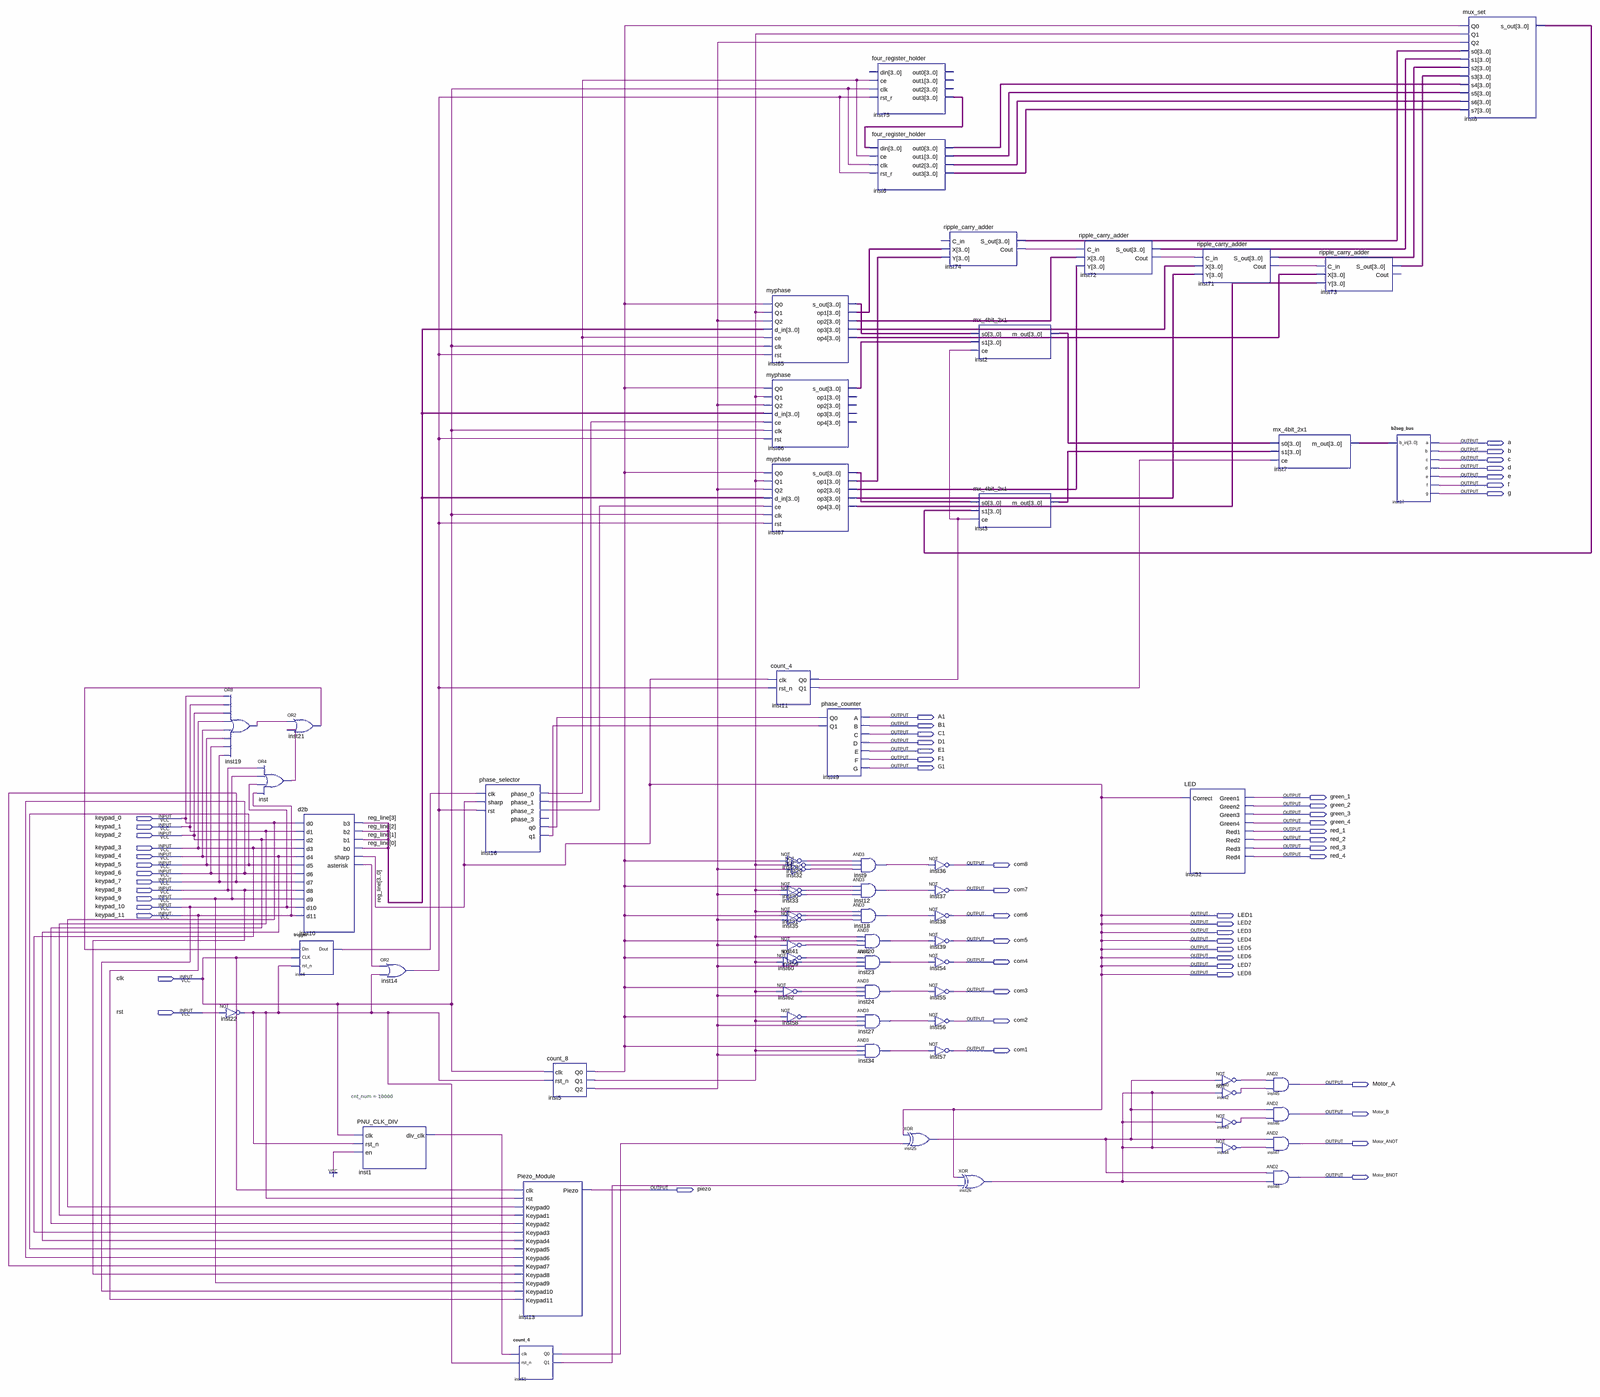
[diagram p0: schematic sheet, whole]
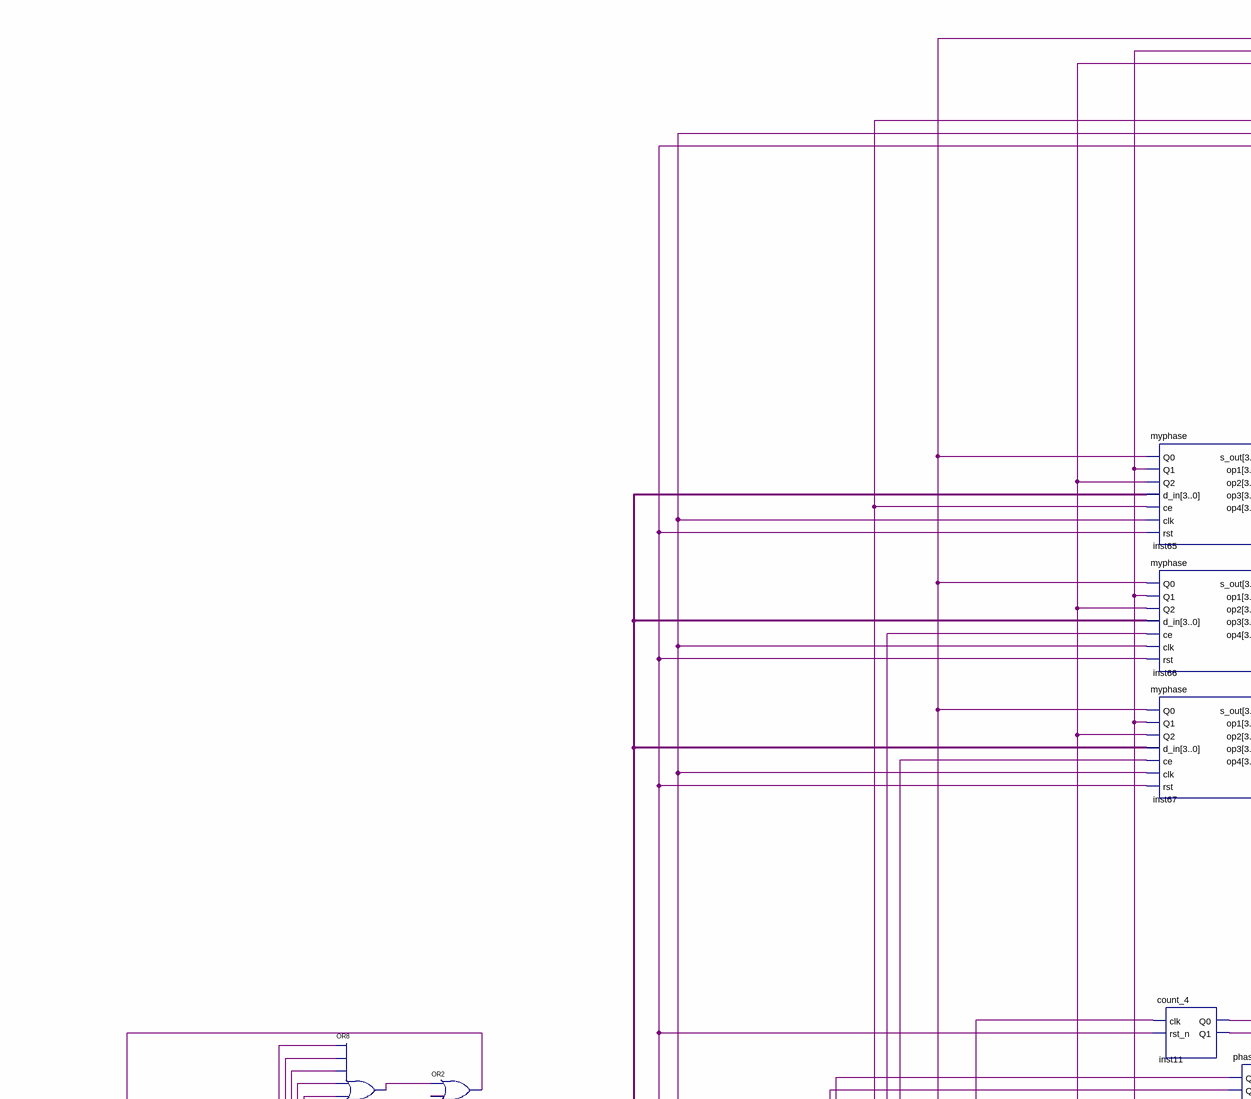
[diagram p1: schematic sheet, upper left part]
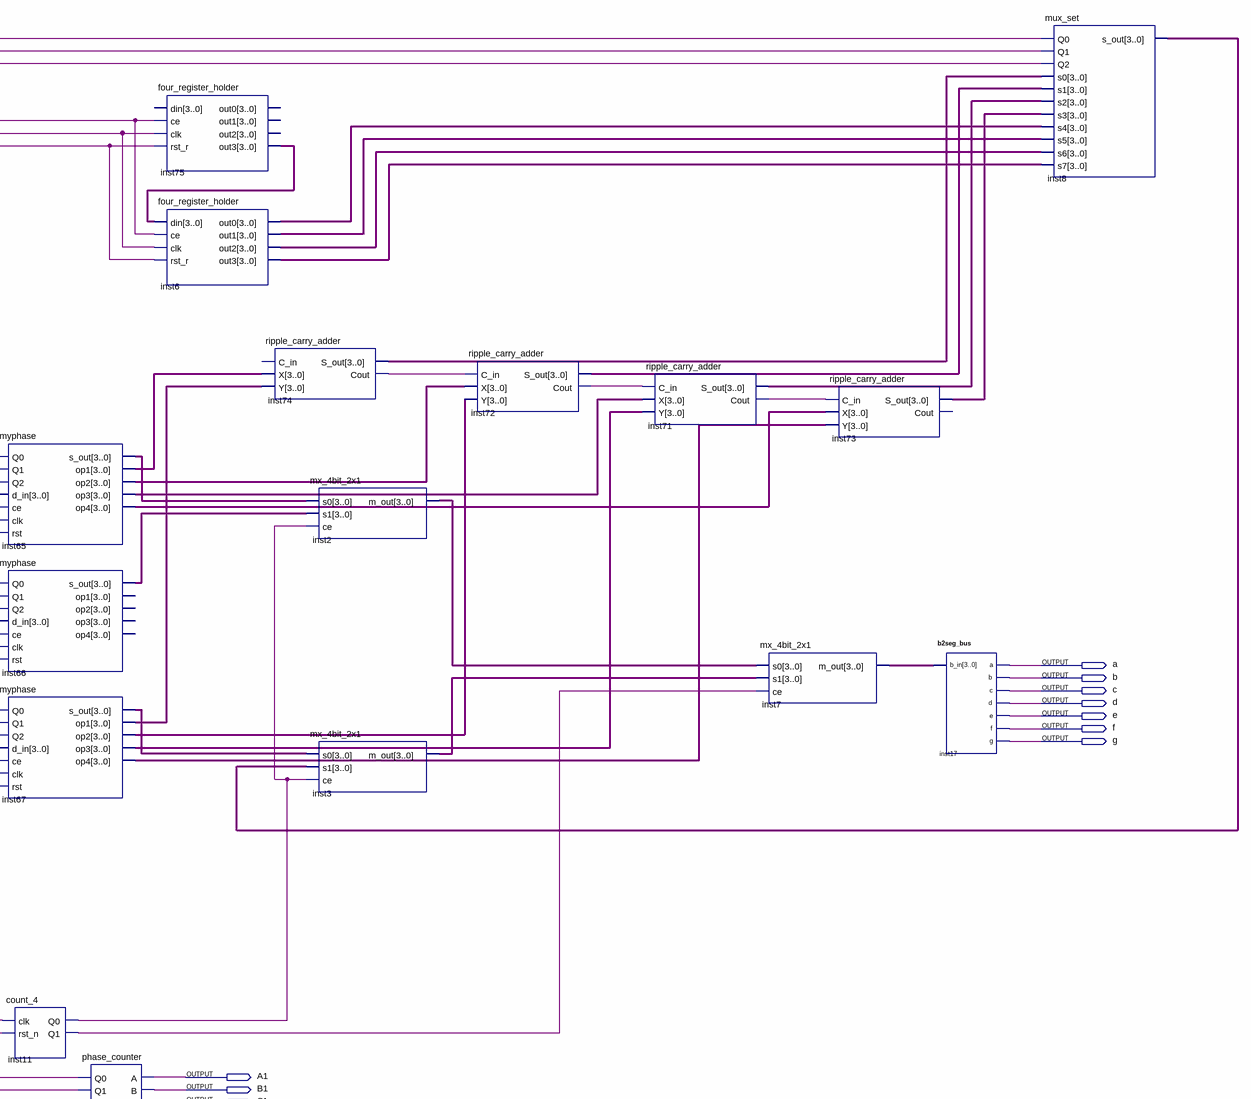
[diagram p2: schematic sheet, upper right part]
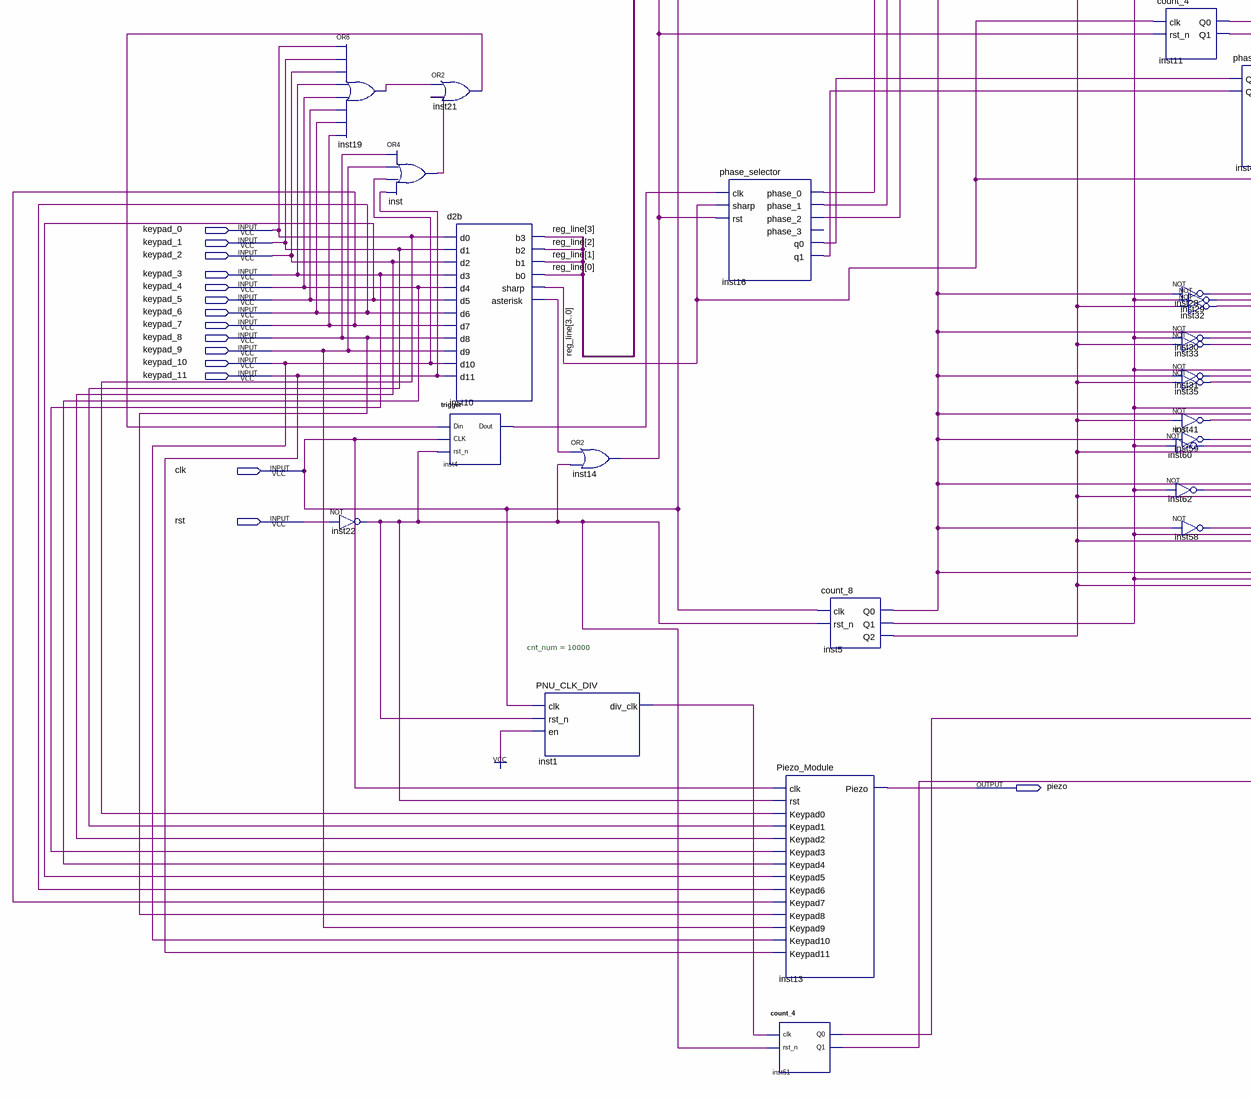
[diagram p3: schematic sheet, lower left part]
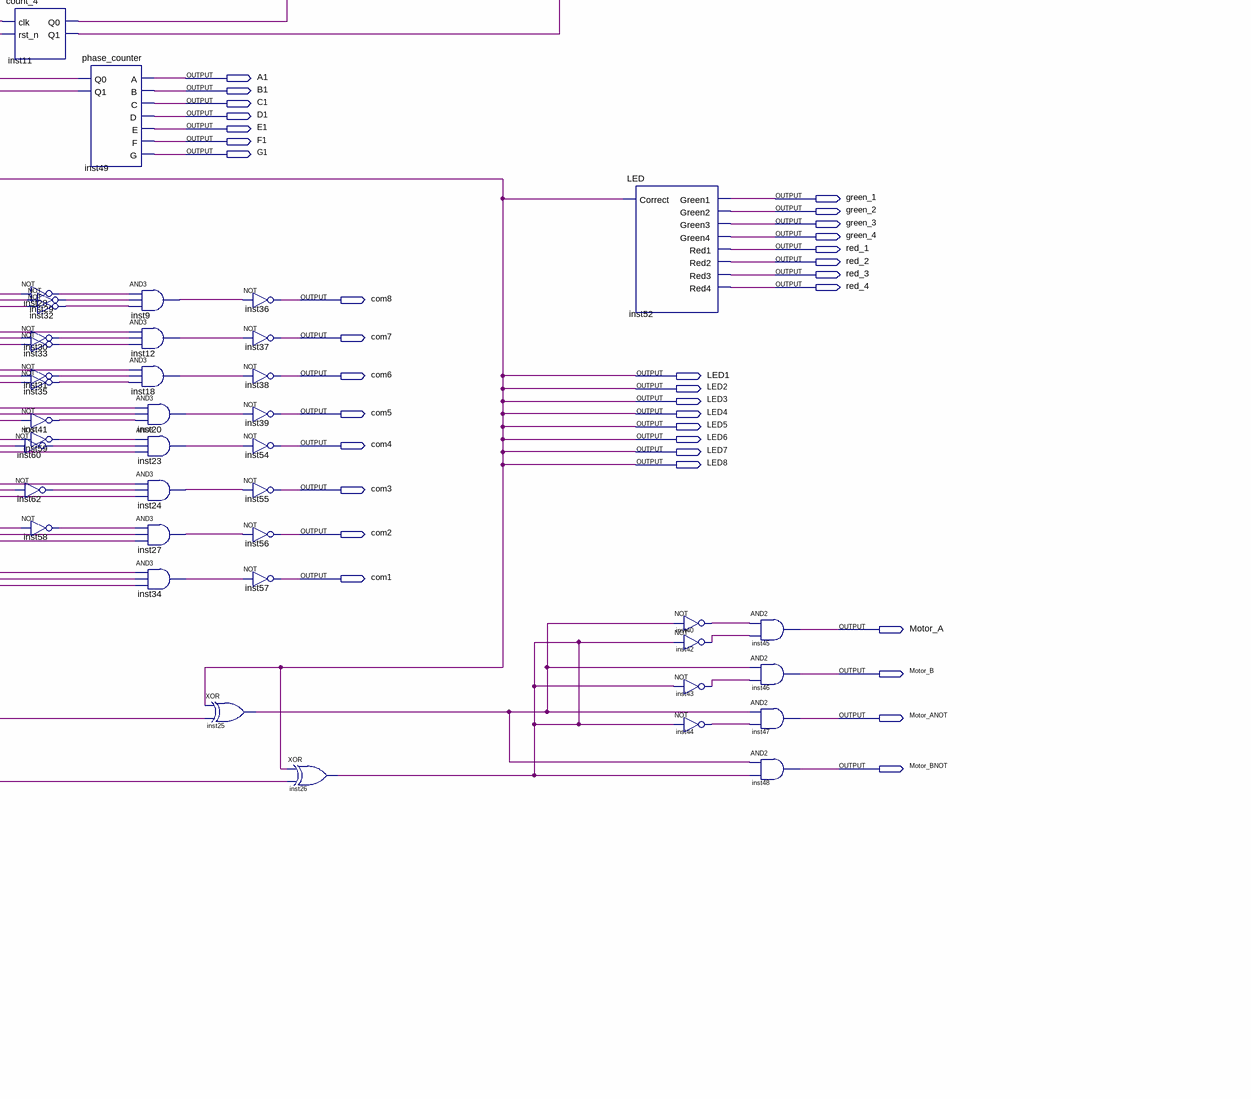
[diagram p4: schematic sheet, lower right part]
// Quartus schematic calculator.bdf as structural Verilog: 67 symbols, 57 pins
module calculator (
  input  keypad_0,
  input  keypad_1,
  input  keypad_2,
  input  keypad_3,
  input  keypad_4,
  input  keypad_5,
  input  keypad_6,
  input  keypad_7,
  input  keypad_8,
  input  keypad_9,
  input  keypad_10,
  input  keypad_11,
  input  clk,
  input  rst,
  output a,
  output b,
  output c,
  output d,
  output e,
  output f,
  output g,
  output A1,
  output B1,
  output C1,
  output D1,
  output E1,
  output F1,
  output G1,
  output green_1,
  output green_2,
  output green_3,
  output green_4,
  output red_1,
  output red_2,
  output red_3,
  output red_4,
  output com8,
  output com7,
  output com6,
  output LED1,
  output LED2,
  output LED3,
  output com5,
  output LED4,
  output LED5,
  output LED6,
  output com4,
  output LED7,
  output LED8,
  output com3,
  output com2,
  output com1,
  output Motor_A,
  output Motor_B,
  output Motor_ANOT,
  output Motor_BNOT,
  output piezo
);

  wire inst1_div_clk, inst4_dout, inst5_q0, inst5_q1, inst5_q2, inst9_out, inst10_asterisk, inst11_q0,
       inst11_q1, inst12_out, inst14_out, inst16_phase_0, inst16_phase_1, inst16_phase_2, inst16_q0,
       inst16_q1, inst18_out, inst19_out, inst20_out, inst21_out, inst22_out, inst23_out, inst24_out,
       inst25_out, inst26_out, inst27_out, inst28_out, inst29_out, inst30_out, inst31_out, inst32_out,
       inst33_out, inst34_out, inst35_out, inst40_out, inst41_out, inst42_out, inst43_out, inst44_out,
       inst51_q0, inst51_q1, inst58_out, inst59_out, inst60_out, inst62_out, inst71_cout, inst72_cout,
       inst74_cout, inst_out;
  wire [3:0] inst2_m_out, inst3_m_out, inst6_out0, inst6_out1, inst6_out2, inst6_out3, inst7_m_out,
       inst8_s_out, inst65_op1, inst65_op2, inst65_op3, inst65_op4, inst65_s_out, inst66_s_out, inst67_op1,
       inst67_op2, inst67_op3, inst67_op4, inst67_s_out, inst71_s_out, inst72_s_out, inst73_s_out,
       inst74_s_out, inst75_out3, reg_line;

  or inst19 (inst19_out, keypad_0, keypad_1, keypad_2, keypad_3, keypad_4, keypad_5, keypad_6, keypad_7);
  not inst22 (inst22_out, rst);
  or inst (inst_out, keypad_8, keypad_9, keypad_10, keypad_11);
  or inst21 (inst21_out, inst19_out, inst_out);
  trigger inst4 (.Din(inst21_out), .CLK(clk), .rst_n(inst22_out), .Dout(inst4_dout));
  d2b inst10 (
    .d0(keypad_0), .d1(keypad_1), .d2(keypad_2), .d3(keypad_3), .d4(keypad_4), .d5(keypad_5), .d6(keypad_6),
    .d7(keypad_7), .d8(keypad_8), .d9(keypad_9), .d10(keypad_10), .d11(keypad_11), .b3(reg_line[3]),
    .b2(reg_line[2]), .b1(reg_line[1]), .b0(reg_line[0]), .sharp(LED1), .asterisk(inst10_asterisk));
  PNU_CLK_DIV #(.cnt_num(10000)) inst1 (.clk(clk), .rst_n(inst22_out), .en(1'b1), .div_clk(inst1_div_clk));
  or inst14 (inst14_out, inst10_asterisk, inst22_out);
  phase_selector inst16 (
    .clk(inst4_dout), .sharp(LED1), .rst(inst14_out), .phase_0(inst16_phase_0), .phase_1(inst16_phase_1),
    .phase_2(inst16_phase_2), .q0(inst16_q0), .q1(inst16_q1));  // open: phase_3
  Piezo_Module inst13 (
    .clk(clk), .rst(inst22_out), .Keypad0(keypad_0), .Keypad1(keypad_1), .Keypad2(keypad_2),
    .Keypad3(keypad_3), .Keypad4(keypad_4), .Keypad5(keypad_5), .Keypad6(keypad_6), .Keypad7(keypad_7),
    .Keypad8(keypad_8), .Keypad9(keypad_9), .Keypad10(keypad_10), .Keypad11(keypad_11), .Piezo(piezo));
  count_4 inst51 (.clk(inst1_div_clk), .rst_n(inst22_out), .Q0(inst51_q0), .Q1(inst51_q1));
  count_8 inst5 (.clk(clk), .rst_n(inst22_out), .Q0(inst5_q0), .Q1(inst5_q1), .Q2(inst5_q2));
  myphase inst65 (
    .Q0(inst5_q0), .Q1(inst5_q1), .Q2(inst5_q2), .d_in(reg_line), .ce(inst16_phase_0), .clk(clk),
    .rst(inst14_out), .s_out(inst65_s_out), .op1(inst65_op1), .op2(inst65_op2), .op3(inst65_op3),
    .op4(inst65_op4));
  myphase inst66 (
    .Q0(inst5_q0), .Q1(inst5_q1), .Q2(inst5_q2), .d_in(reg_line), .ce(inst16_phase_1), .clk(clk),
    .rst(inst14_out), .s_out(inst66_s_out));  // open: op1, op2, op3, op4
  myphase inst67 (
    .Q0(inst5_q0), .Q1(inst5_q1), .Q2(inst5_q2), .d_in(reg_line), .ce(inst16_phase_2), .clk(clk),
    .rst(inst14_out), .s_out(inst67_s_out), .op1(inst67_op1), .op2(inst67_op2), .op3(inst67_op3),
    .op4(inst67_op4));
  count_4 inst11 (.clk(LED1), .rst_n(inst14_out), .Q0(inst11_q0), .Q1(inst11_q1));
  not inst28 (inst28_out, inst5_q0);
  not inst29 (inst29_out, inst5_q1);
  not inst32 (inst32_out, inst5_q2);
  not inst30 (inst30_out, inst5_q1);
  not inst33 (inst33_out, inst5_q2);
  not inst31 (inst31_out, inst5_q0);
  not inst35 (inst35_out, inst5_q2);
  not inst41 (inst41_out, inst5_q2);
  not inst59 (inst59_out, inst5_q0);
  not inst60 (inst60_out, inst5_q1);
  not inst62 (inst62_out, inst5_q1);
  not inst58 (inst58_out, inst5_q0);
  phase_counter inst49 (.Q0(inst16_q0), .Q1(inst16_q1), .A(A1), .B(B1), .C(C1), .D(D1), .E(E1), .F(F1), .G(G1));
  and inst9 (inst9_out, inst28_out, inst29_out, inst32_out);
  and inst12 (inst12_out, inst5_q0, inst30_out, inst33_out);
  and inst18 (inst18_out, inst5_q1, inst31_out, inst35_out);
  and inst20 (inst20_out, inst5_q1, inst5_q0, inst41_out);
  and inst23 (inst23_out, inst59_out, inst60_out, inst5_q2);
  and inst24 (inst24_out, inst5_q0, inst62_out, inst5_q2);
  and inst27 (inst27_out, inst58_out, inst5_q1, inst5_q2);
  and inst34 (inst34_out, inst5_q0, inst5_q1, inst5_q2);
  four_register_holder inst75 (
    .ce(inst16_phase_0), .clk(clk), .rst_r(inst14_out), .out3(inst75_out3));  // open: din, out0, out1, out2
  four_register_holder inst6 (
    .din(inst75_out3), .ce(inst16_phase_0), .clk(clk), .rst_r(inst14_out), .out0(inst6_out0),
    .out1(inst6_out1), .out2(inst6_out2), .out3(inst6_out3));
  not inst36 (com8, inst9_out);
  not inst37 (com7, inst12_out);
  not inst38 (com6, inst18_out);
  not inst39 (com5, inst20_out);
  not inst54 (com4, inst23_out);
  not inst55 (com3, inst24_out);
  not inst56 (com2, inst27_out);
  not inst57 (com1, inst34_out);
  xor inst25 (inst25_out, LED1, inst51_q0);
  ripple_carry_adder inst74 (.X(inst65_op1), .Y(inst67_op1), .S_out(inst74_s_out), .Cout(inst74_cout));  // open: C_in
  xor inst26 (inst26_out, LED1, inst51_q1);
  mx_4bit_2x1 inst2 (.s0(inst65_s_out), .s1(inst66_s_out), .ce(inst11_q0), .m_out(inst2_m_out));
  mx_4bit_2x1 inst3 (.s0(inst67_s_out), .s1(inst8_s_out), .ce(inst11_q0), .m_out(inst3_m_out));
  ripple_carry_adder inst72 (
    .C_in(inst74_cout), .X(inst65_op2), .Y(inst67_op2), .S_out(inst72_s_out), .Cout(inst72_cout));
  ripple_carry_adder inst71 (
    .C_in(inst72_cout), .X(inst65_op3), .Y(inst67_op3), .S_out(inst71_s_out), .Cout(inst71_cout));
  LED inst52 (
    .Correct(LED1), .Green1(green_1), .Green2(green_2), .Green3(green_3), .Green4(green_4), .Red1(red_1),
    .Red2(red_2), .Red3(red_3), .Red4(red_4));
  not inst40 (inst40_out, inst25_out);
  not inst42 (inst42_out, inst26_out);
  not inst43 (inst43_out, inst26_out);
  not inst44 (inst44_out, inst26_out);
  mx_4bit_2x1 inst7 (.s0(inst2_m_out), .s1(inst3_m_out), .ce(inst11_q1), .m_out(inst7_m_out));
  and inst45 (Motor_A, inst40_out, inst42_out);
  and inst46 (Motor_B, inst25_out, inst43_out);
  and inst47 (Motor_ANOT, inst25_out, inst44_out);
  and inst48 (Motor_BNOT, inst25_out, inst26_out);
  ripple_carry_adder inst73 (.C_in(inst71_cout), .X(inst65_op4), .Y(inst67_op4), .S_out(inst73_s_out));  // open: Cout
  b2seg_bus inst17 (.b_in(inst7_m_out), .a(a), .b(b), .c(c), .d(d), .e(e), .f(f), .g(g));
  mux_set inst8 (
    .Q0(inst5_q0), .Q1(inst5_q1), .Q2(inst5_q2), .s0(inst74_s_out), .s1(inst72_s_out), .s2(inst71_s_out),
    .s3(inst73_s_out), .s4(inst6_out0), .s5(inst6_out1), .s6(inst6_out2), .s7(inst6_out3), .s_out(inst8_s_out));

  assign LED2 = LED1;
  assign LED3 = LED1;
  assign LED4 = LED1;
  assign LED5 = LED1;
  assign LED6 = LED1;
  assign LED7 = LED1;
  assign LED8 = LED1;
endmodule
